# Altium project Flight_Controller_v1.PrjPcb (part 1 of 2)
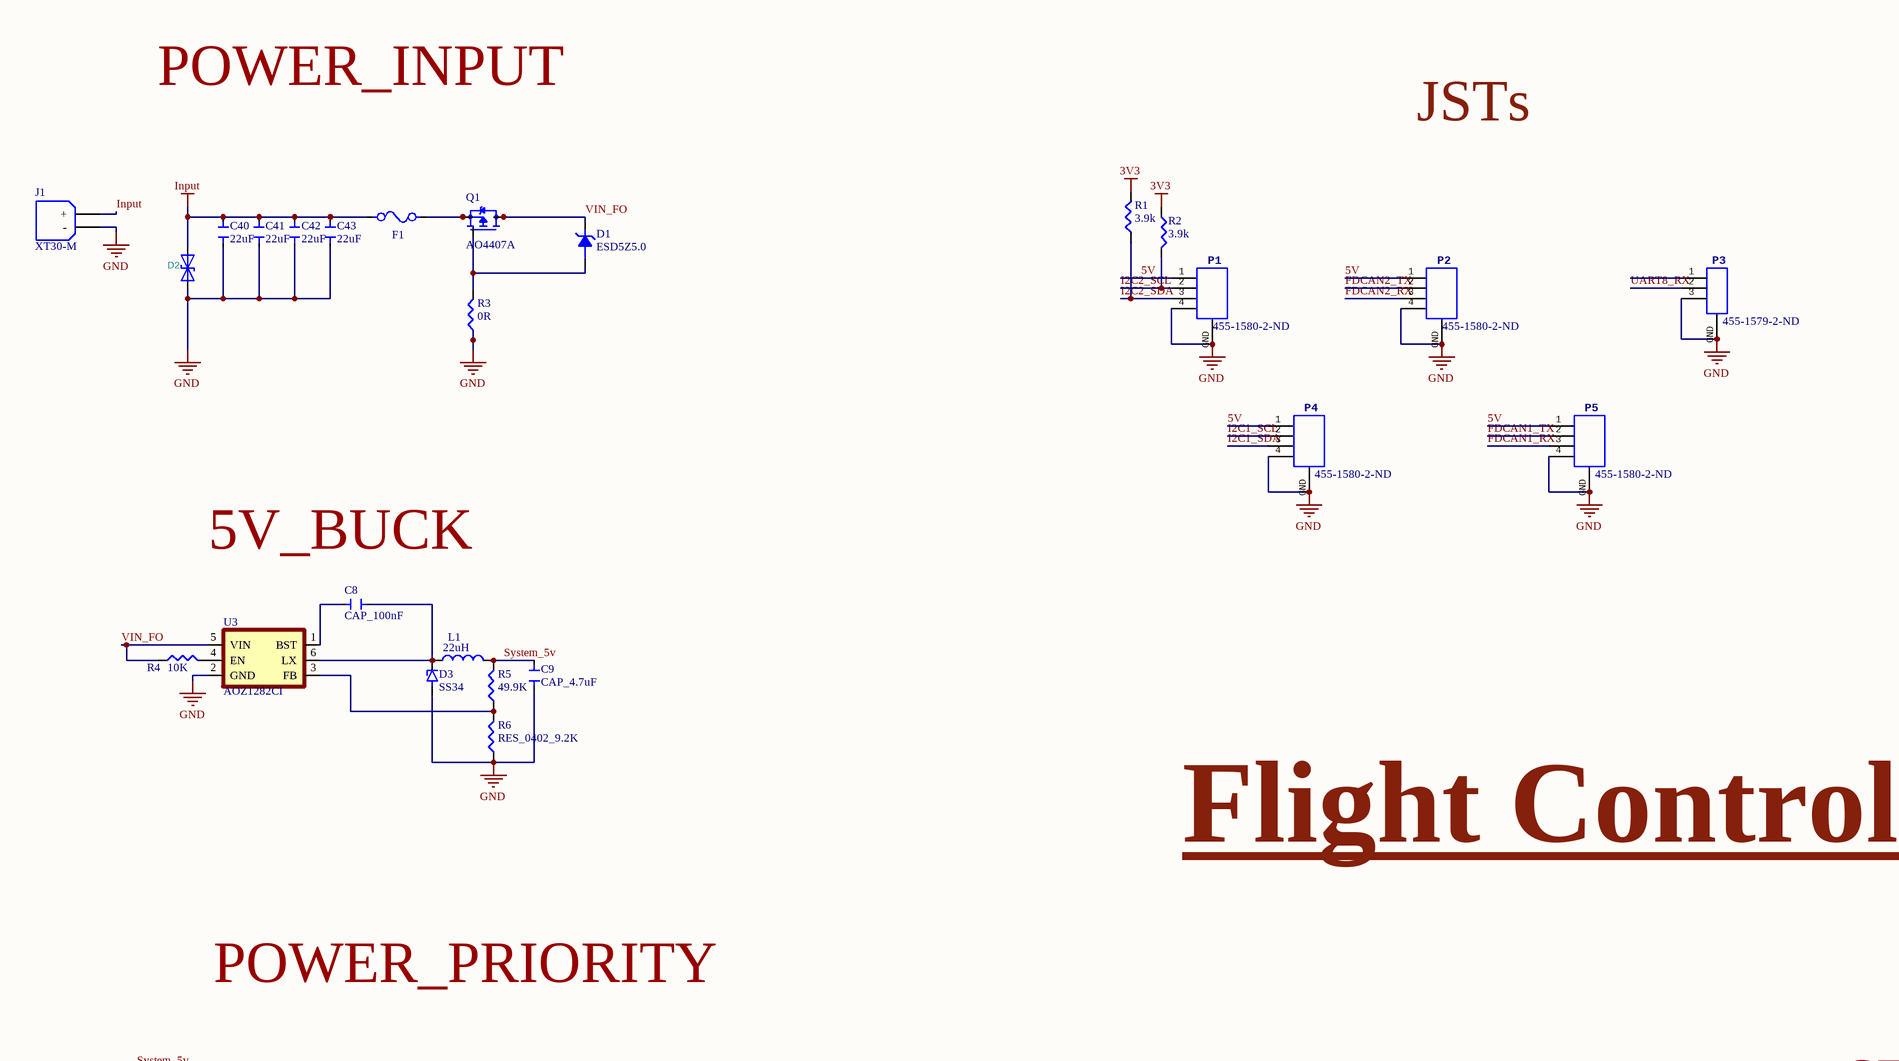
[diagram p0: Flight_Controller_v1.SchDoc, top left]
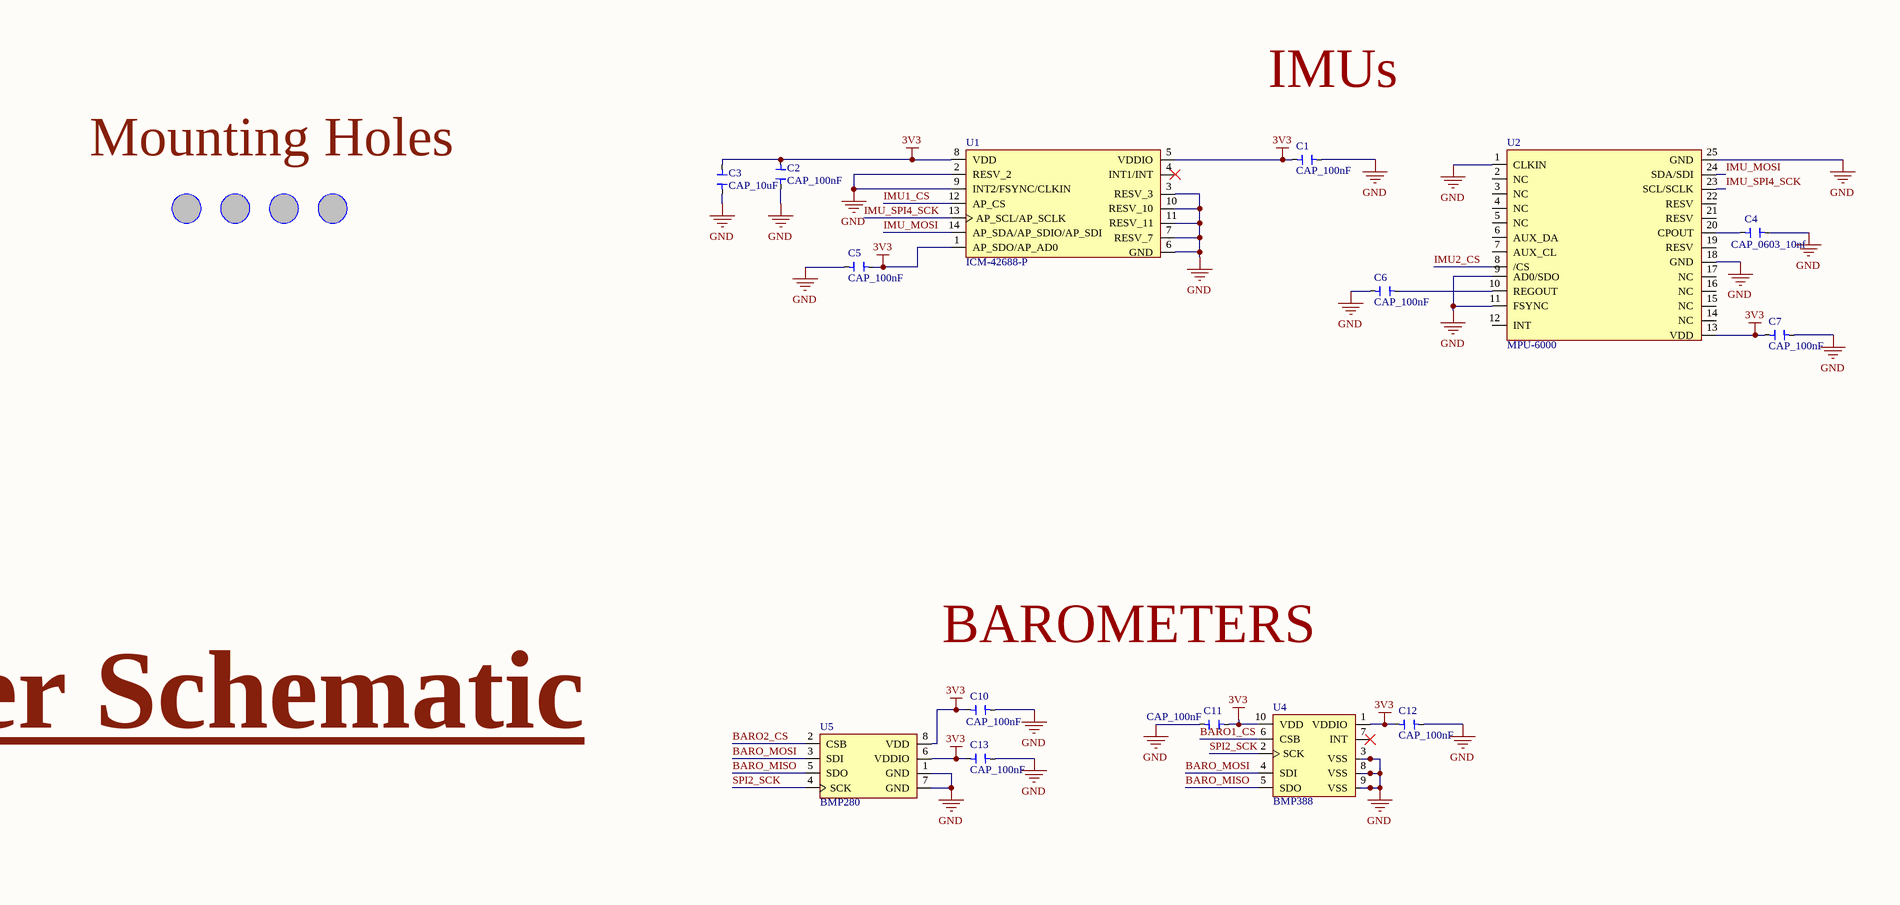
[diagram p1: Flight_Controller_v1.SchDoc, top right]
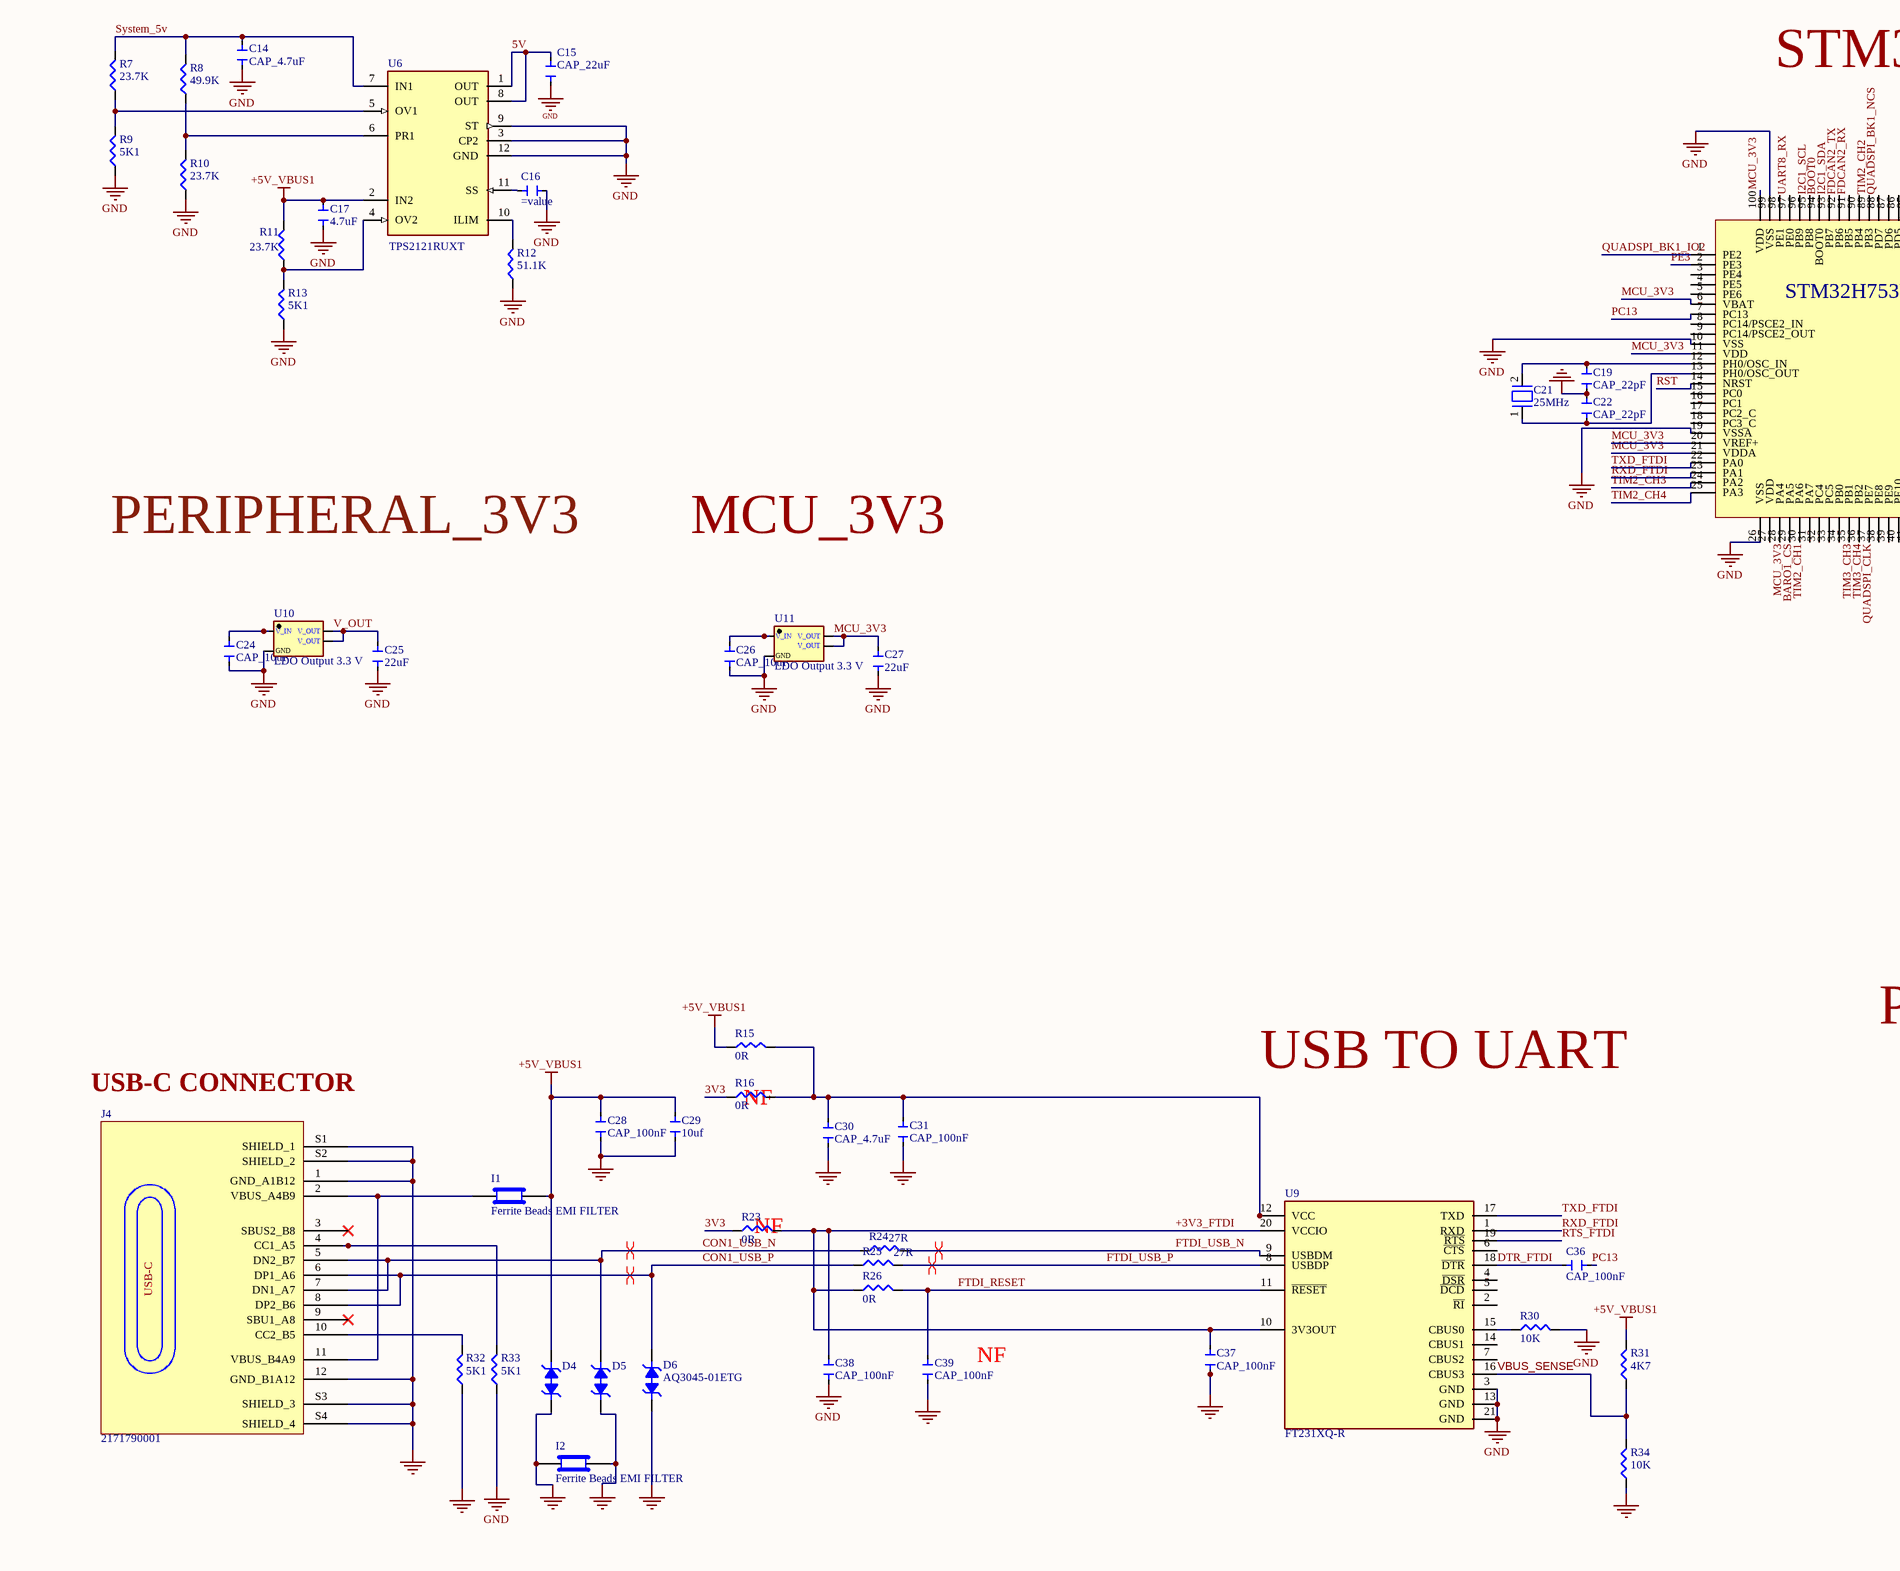
[diagram p2: Flight_Controller_v1.SchDoc, bottom left]
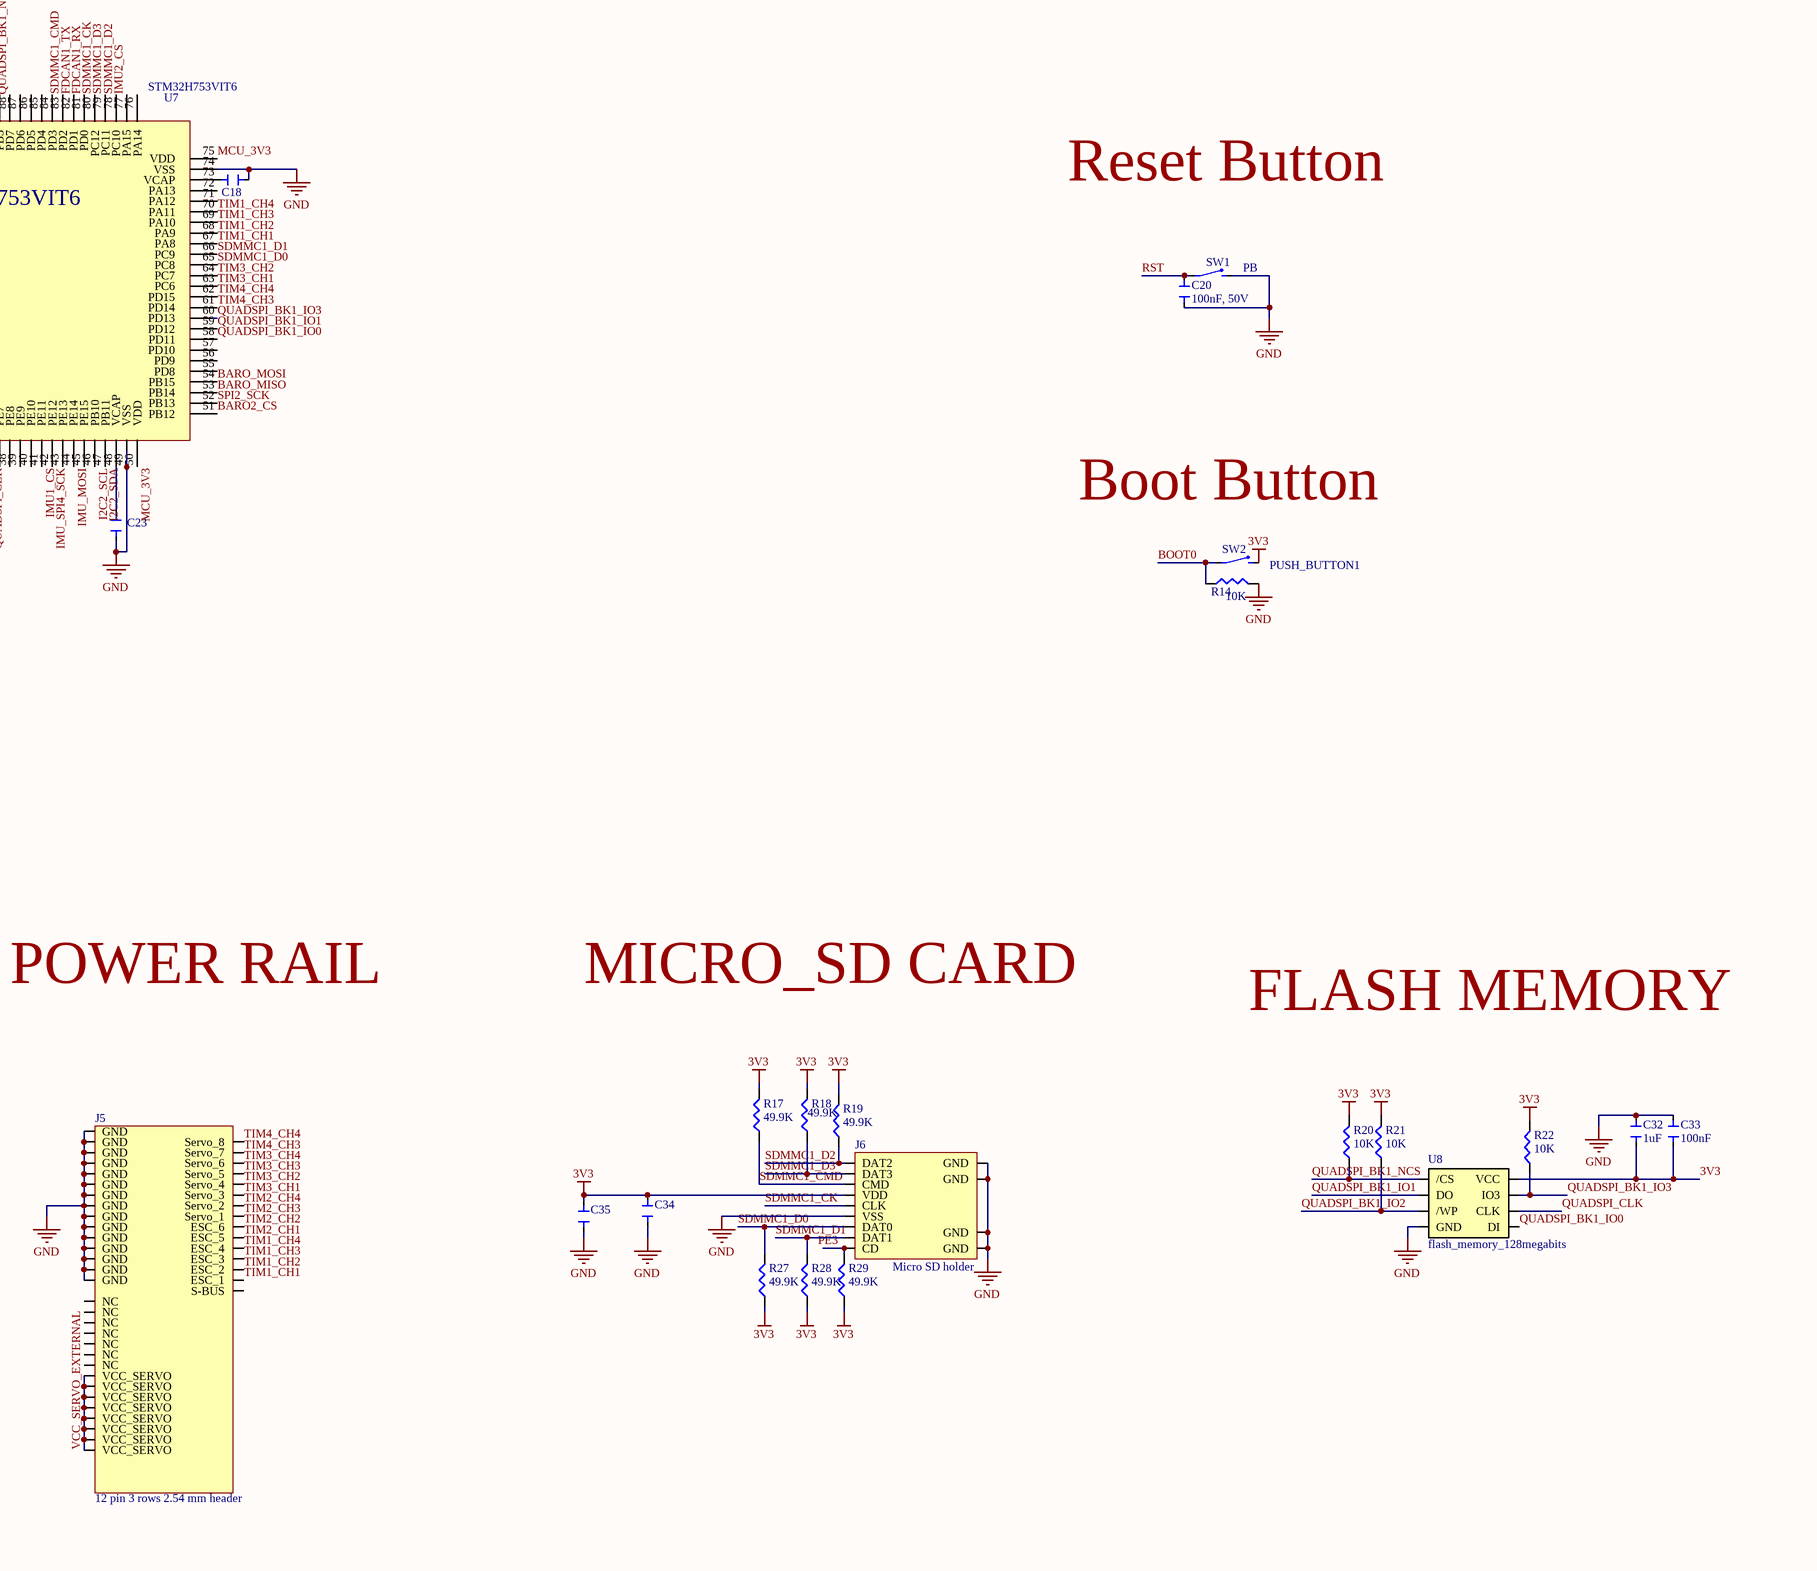
[diagram p3: Flight_Controller_v1.SchDoc, bottom right]
1 sheet, 110 parts. Net scope: global (net labels, ports and power ports of the same name join across sheets).
Board file: Flight_Controller_PCB.PcbDoc

## Sheet Flight_Controller_v1.SchDoc
size A1; SheetNumber: 1; SheetTotal: 1

### Parts
C1  CAP_100nF  [CAP_100nF]
C2  CAP_100nF  [CAP_100nF]
C3  CAP_10uF  [CAP_10uF]
C4  CAP_0603_10nf  [CAP_100nF]
C5  CAP_100nF  [CAP_100nF]
C6  CAP_100nF  [CAP_100nF]
C7  CAP_100nF  [CAP_100nF]
C8  CAP_100nF  [CAP_100nF]
C9  CAP_4.7uF  [CAP_4.7uF]
C10  CAP_100nF  [CAP_100nF]
C11  CAP_100nF  [CAP_100nF]
C12  CAP_100nF  [CAP_100nF]
C13  CAP_100nF  [CAP_100nF]
C14  CAP_4.7uF  [CAP_4.7uF]
C15  CAP_22uF  [CAP_22uF]
C16  (no value)  [CAP_100nF]
C17  4.7uF  [CAP_4.7uF]
C18  CAP_2.2uF  [CAP_4.7uF]  (value not drawn)
C19  CAP_22pF  [CAP_0402]
C20  100nF, 50V  [CAP_0402]
C21  25MHz  [XTAL 25 MHZ]
C22  CAP_22pF  [CAP_0402]
C23  CAP_2.2uF  [CAP_4.7uF]  (value not drawn)
C24  CAP_10uF  [CAP_10uF]
C25  22uF  [CAP_22uF]
C26  CAP_10uF  [CAP_10uF]
C27  22uF  [CAP_22uF]
C28  CAP_100nF  [CAP_100nF]
C29  10uf  [CAP_10uF]
C30  CAP_4.7uF  [CAP_4.7uF]
C31  CAP_100nF  [CAP_100nF]
C32  1uF  [CAP_4.7uF]
C33  100nF  [CAP_100nF]
C34  CAP_4.7uF  [CAP_4.7uF]  (value not drawn)
C35  CAP_100nF  [CAP_100nF]  (value not drawn)
C36  CAP_100nF  [CAP_100nF]
C37  CAP_100nF  [CAP_100nF]
C38  CAP_100nF  [CAP_100nF]
C39  CAP_100nF  [CAP_100nF]
C40  22uF  [CAP_22uF]
C41  22uF  [CAP_22uF]
C42  22uF  [CAP_22uF]
C43  22uF  [CAP_22uF]
D1  ESD5Z5.0  [SOD-523]
D2  TVS-bidirectional-Diode  [SOD-123FL_bi]  (value not drawn)
D3  SS34  [DIO_SS34]
D4  AQ3045-01ETG  [SOD882]  (value not drawn)
D5  (no value)  [SOD882]
D6  AQ3045-01ETG  [SOD882]
F1  0451020.MRL  [FP-0451-MFG]  (value not drawn)
I1  Ferrite Beads EMI FILTER  [KYOCERA-KNH16-DA]
I2  Ferrite Beads EMI FILTER  [KYOCERA-KNH16-DA]
J1  XT30-M  [XT30PW-M]
J4  2171790001  [USB_C]
J5  12 pin 3 rows 2.54 mm header  [PGA225x15]
J6  Micro SD holder  [Edge Connector]
L1  22uH  [12.3x12.3 - duplicate]
P1  Supplier Part Number 1: 455-1580-2-ND  [JST_GH_V4]  (hidden comment: JST_GH_V4)
P2  Supplier Part Number 1: 455-1580-2-ND  [JST_GH_V4]  (hidden comment: JST_GH_V4)
P3  Supplier Part Number 1: 455-1579-2-ND  [JST_GH_V3]  (hidden comment: JST_GH_V3)
P4  Supplier Part Number 1: 455-1580-2-ND  [JST_GH_V4]  (hidden comment: JST_GH_V4)
P5  Supplier Part Number 1: 455-1580-2-ND  [JST_GH_V4]  (hidden comment: JST_GH_V4)
Q1  AO4407A  [AO4407A]
R1  3.9k  [RES_3.9K]
R2  3.9k  [RES_3.9K]
R3  0R  [RES_SMD_0402]
R4  10K  [RES_SMD_0402]
R5  49.9K  [RES_SMD_0603]
R6  RES_0402_9.2K  [RES_SMD_0402]
R7  23.7K  [RES_SMD_0603]
R8  49.9K  [RES_SMD_0603]
R9  5K1  [RES_SMD_0402]
R10  23.7K  [RES_SMD_0603]
R11  23.7K  [RES_SMD_0603]
R12  51.1K  [RES_SMD_0603]
R13  5K1  [RES_SMD_0402]
R14  10K  [RES_SMD_0402]
R15  0R  [RES_SMD_0402]
R16  0R  [RES_SMD_0402]
R17  49.9K  [RES_SMD_0603]
R18  49.9K  [RES_SMD_0603]
R19  49.9K  [RES_SMD_0603]
R20  10K  [RES_SMD_0402]
R21  10K  [RES_SMD_0402]
R22  10K  [RES_SMD_0402]
R23  0R  [RES_SMD_0402]
R24  27R  [RES_SMD_0402]
R25  27R  [RES_SMD_0402]
R26  0R  [RES_SMD_0402]
R27  49.9K  [RES_SMD_0603]
R28  49.9K  [RES_SMD_0603]
R29  49.9K  [RES_SMD_0603]
R30  10K  [RES_SMD_0402]
R31  4K7  [RES_SMD_0402]
R32  5K1  [RES_SMD_0402]
R33  5K1  [RES_SMD_0402]
R34  10K  [RES_SMD_0402]
SW1  PB  [PUSH_BUTTON1]
SW2  PUSH_BUTTON1  [PUSH_BUTTON1]
U1  ICM-42688-P  [PQFN50P300X250X97-14N]
U2  MPU-6000  [MPU-6000]
U3  AOZ1282CI  [AOZ1282CI]
U4  BMP388  [PQFN50P200X200X80-10N]
U5  BMP280  [XDCR_BMP280]
U6  TPS2121RUXT  [FP-RUX0012A-MFG]
U7  STM32H753VIT6  [LQFP100-14x14mm]
U8  flash_memory_128megabits  [SOIC-8-208mil]
U9  FT231XQ-R  [FP-QFN-20-IPC_B]
U10  LDO Output 3.3 V  [AMS1117]
U11  LDO Output 3.3 V  [AMS1117]

### Nets
3V3: C1.1 C2.1 C3.2 C5.1 C7.1 C10.1 C11.1 C12.1 C13.1 C32.2 C33.1 C34.1 C35.1 J6.4(VDD) R1.2 R2.1 R16.1 R17.2 R18.2 R19.2 R20.2 R21.2 R22.2 R23.1 R27.1 R28.1 R29.1 SW2.2 U1.1(AP_SDO/AP_AD0) U1.5(VDDIO) U1.8(VDD) U2.13(VDD) U4.1(VDDIO) U4.10(VDD) U5.6(VDDIO) U5.8(VDD) U8.8(VCC)
+5V_VBUS1: C17.2 C28.2 C29.2 D4.2 I1.2 R11.2 R15.1 R31.2 U6.2(IN2)
GND: C1.2 C2.2 C3.1 C4.2 C5.2 C6.1 C7.2 C9.1 C10.2 C11.2 C12.2 C13.2 C14.1 C15.1 C16.2 C17.1 C18.2 C19.1 C20.1 C22.2 C23.2 C24.1 C25.1 C26.1 C27.1 C28.1 C29.1 C30.1 C31.1 C32.1 C33.2 C34.2 C35.2 C37.1 C38.1 C39.1 C40.1 C41.1 C42.1 C43.1 D2.1 D3.A D4.1 D5.1 D6.1 I2.1 I2.2 J1.2(-) J4.1(GND_A1B12) J4.12(GND_B1A12) J4.S1(SHIELD_1) J4.S2(SHIELD_2) J4.S3(SHIELD_3) J4.S4(SHIELD_4) J5.1(GND) J5.2(GND) J5.3(GND) J5.4(GND) J5.5(GND) J5.6(GND) J5.7(GND) J5.8(GND) J5.9(GND) J5.10(GND) J5.11(GND) J5.12(GND) J5.13(GND) J5.14(GND) J5.15(GND) J6.6(VSS) J6.10(GND) J6.11(GND) J6.12(GND) J6.13(GND) P1.4 P1.GND P2.4 P2.GND P3.3 P3.GND P4.4 P4.GND P5.4 P5.GND R3.1 R6.1 R9.1 R10.1 R12.1 R13.1 R14.2 R30.2 R32.1 R33.1 R34.1 SW1.2 U1.2(RESV_2) U1.3(RESV_3) U1.6(GND) U1.7(RESV_7) U1.9(INT2/FSYNC/CLKIN) U1.10(RESV_10) U1.11(RESV_11) U2.1(CLKIN) U2.9(AD0/SDO) U2.11(FSYNC) U2.18(GND) U2.25(GND) U3.2(GND) U4.3(VSS) U4.8(VSS) U4.9(VSS) U5.1(GND) U5.7(GND) U6.3(CP2) U6.9(ST) U6.12(GND) U7.10(VSS) U7.19(VSSA) U7.26(VSS) U7.49(VSS) U7.74(VSS) U7.99(VSS) U8.4(GND) U9.3(GND) U9.13(GND) U9.21(GND) U10.1(GND) U11.1(GND)
Input: C40.2 C41.2 C42.2 C43.2 D2.2 F1.1 J1.1(+)
5V: C15.2 P1.1 P2.1 P4.1 P5.1 U6.1(OUT) U6.8(OUT)
+3V3_FTDI: C37.2 C38.2 R23.2 R26.1 U9.10(3V3OUT) U9.20(VCCIO)
BARO1_CS: U4.6(CSB) U7.28(PA4)
BARO2_CS: U5.2(CSB) U7.51(PB12)
BARO_MISO: U4.5(SDO) U5.5(SDO) U7.53(PB14)
BARO_MOSI: U4.4(SDI) U5.3(SDI) U7.54(PB15)
BOOT0: R14.1 SW2.1 U7.94(BOOT0)
CON1_USB_N: D5.2 J4.5(DN2_B7) J4.7(DN1_A7) R24.1
CON1_USB_P: D6.2 J4.6(DP1_A6) J4.8(DP2_B6) R25.1
DTR_FTDI: C36.1 U9.18(~{DTR})
FDCAN1_RX: P5.3 U7.81(PD0)
FDCAN1_TX: P5.2 U7.82(PD1)
FDCAN2_RX: P2.3 U7.91(PB5)
FDCAN2_TX: P2.2 U7.92(PB6)
FTDI_RESET: C39.2 R26.2 U9.11(~{RESET})
FTDI_USB_N: R24.2 U9.9(USBDM)
FTDI_USB_P: R25.2 U9.8(USBDP)
I2C1_SCL: P4.2 U7.95(PB8)
I2C1_SDA: P4.3 U7.93(PB7)
I2C2_SCL: P1.2 R2.2 U7.46(PB10)
I2C2_SDA: P1.3 R1.1 U7.47(PB11)
IMU1_CS: U1.12(AP_CS) U7.41(PE11)
IMU2_CS: U2.8(/CS) U7.77(PA15)
IMU_MOSI: U1.14(AP_SDA/AP_SDIO/AP_SDI) U2.24(SDA/SDI) U7.44(PE14)
IMU_SPI4_SCK: U1.13(AP_SCL/AP_SCLK) U2.23(SCL/SCLK) U7.42(PE12)
MCU_3V3: C27.2 U7.6(VBAT) U7.11(VDD) U7.20(VREF+) U7.21(VDDA) U7.27(VDD) U7.50(VDD) U7.75(VDD) U7.100(VDD) U11.2(V_OUT) U11.4(V_OUT)
PC13: C36.2 U7.7(PC13)
PE3: U7.2(PE3)
QUADSPI_BK1_IO0: U7.58(PD11) U8.5(DI)
QUADSPI_BK1_IO1: U7.59(PD12) U8.2(DO)
QUADSPI_BK1_IO2: R21.1 U7.1(PE2) U8.3(/WP)
QUADSPI_BK1_IO3: R22.1 U7.60(PD13) U8.7(IO3)
QUADSPI_BK1_NCS: R20.1 U7.88(PD7) U8.1(/CS)
QUADSPI_CLK: U7.36(PB2) U8.6(CLK)
RST: C20.2 SW1.1 U7.14(NRST)
RTS_FTDI: U9.19(~{RTS})
RXD_FTDI: U7.23(PA1) U9.1(RXD)
SDMMC1_CK: J6.5(CLK) U7.80(PC12)
SDMMC1_CMD: J6.3(CMD) R17.1 U7.83(PD2)
SDMMC1_D0: J6.7(DAT0) R27.2 U7.65(PC8)
SDMMC1_D1: J6.8(DAT1) R28.2 U7.66(PC9)
SDMMC1_D2: J6.1(DAT2) R19.1 U7.78(PC10)
SDMMC1_D3: J6.2(DAT3) R18.1 U7.79(PC11)
SPI2_SCK: U4.2(SCK) U5.4(SCK) U7.52(PB13)
System_5v: C9.2 C14.2 L1.2 R5.2 R7.2 R8.2 U6.7(IN1)
TIM1_CH1: J5.32(ESC_1) U7.67(PA8)
TIM1_CH2: J5.33(ESC_2) U7.68(PA9)
TIM1_CH3: J5.34(ESC_3) U7.69(PA10)
TIM1_CH4: J5.35(ESC_4) U7.70(PA11)
TIM2_CH1: J5.36(ESC_5) U7.29(PA5)
TIM2_CH2: J5.37(ESC_6) U7.89(PB3)
TIM2_CH3: J5.38(Servo_1) U7.24(PA2)
TIM2_CH4: J5.39(Servo_2) U7.25(PA3)
TIM3_CH1: J5.40(Servo_3) U7.63(PC6)
TIM3_CH2: J5.41(Servo_4) U7.64(PC7)
TIM3_CH3: J5.42(Servo_5) U7.34(PB0)
TIM3_CH4: J5.43(Servo_6) U7.35(PB1)
TIM4_CH3: J5.44(Servo_7) U7.61(PD14)
TIM4_CH4: J5.45(Servo_8) U7.62(PD15)
TXD_FTDI: U7.22(PA0) U9.17(TXD)
UART8_RX: P3.2 U7.97(PE0)
V_OUT: C25.2 U10.2(V_OUT) U10.4(V_OUT)
VBUS_SENSE: R31.1 R34.2 U9.16(CBUS3)
VCC_SERVO_EXTERNAL: J5.23(VCC_SERVO) J5.24(VCC_SERVO) J5.25(VCC_SERVO) J5.26(VCC_SERVO) J5.27(VCC_SERVO) J5.28(VCC_SERVO) J5.29(VCC_SERVO) J5.30(VCC_SERVO)
VIN_FO: D1.K Q1.5(D) Q1.6(D) Q1.7(D) Q1.8(D) R4.1 U3.5(VIN)
NetC4_1: C4.1 U2.20(CPOUT)
NetC6_2: C6.2 U2.10(REGOUT)
NetC8_1: C8.1 D3.C L1.1 U3.6(LX)
NetC8_2: C8.2 U3.1(BST)
NetC16_1: C16.1 U6.11(SS)
NetC18_1: C18.1 U7.73(VCAP)
NetC19_2: C19.2 C21.2 U7.12(PH0/OSC_IN)
NetC21_1: C21.1 C22.1 U7.13(PH0/OSC_OUT)
NetC23_1: C23.1 U7.48(VCAP)
NetC24_2: C24.2 U10.3(V_IN)
NetC26_2: C26.2 U11.3(V_IN)
NetC30_2: C30.2 C31.2 R15.2 R16.2 U9.12(VCC)
NetD1_A: D1.A Q1.4(G) R3.2
NetF1_2: F1.2 Q1.1(S) Q1.2(S) Q1.3(S)
NetI1_1: I1.1 J4.2(VBUS_A4B9) J4.11(VBUS_B4A9)
NetJ4_4: J4.4(CC1_A5) R33.2
NetJ4_10: J4.10(CC2_B5) R32.2
NetJ6_9: J6.9(CD) R29.2
NetR4_2: R4.2 U3.4(EN)
NetR5_1: R5.1 R6.2 U3.3(FB)
NetR7_1: R7.1 R9.2 U6.5(OV1)
NetR8_1: R8.1 R10.2 U6.6(PR1)
NetR11_1: R11.1 R13.2 U6.4(OV2)
NetR12_2: R12.2 U6.10(ILIM)
NetR30_1: R30.1 U9.15(CBUS0)

Not connected (* = marked no-connect by the designer): J4 3(SBUS2_B8)* 9(SBU1_A8)*; J5 16(NC) 17(NC) 18(NC) 19(NC) 20(NC) 21(NC) 22(NC) 31(S-BUS); P3 1; U1 4(INT1/INT)*; U2 2(NC) 3(NC) 4(NC) 5(NC) 6(AUX_DA) 7(AUX_CL) 12(INT) 14(NC) 15(NC) 16(NC) 17(NC) 19(RESV) 21(RESV) 22(RESV); U4 7(INT)*; U7 3(PE4) 4(PE5) 5(PE6) 8(PC14/PSCE2_IN) 9(PC14/PSCE2_OUT) 15(PC0) 16(PC1) 17(PC2_C) 18(PC3_C) 30(PA6) 31(PA7) 32(PC4) 33(PC5) 37(PE7) 38(PE8) 39(PE9) 40(PE10) 43(PE13) 45(PE15) 55(PD8) 56(PD9) 57(PD10) 71(PA12) 72(PA13) 76(PA14) 84(PD3) 85(PD4) 86(PD5) 87(PD6) 90(PB4) 96(PB9) 98(PE1); U9 2(~{RI}) 4(~{DSR}) 5(~{DCD}) 6(~{CTS}) 7(CBUS2) 14(CBUS1)

### Layout directives
differential pair; differential pair class DIFF90: CON1_USB_N, CON1_USB_P, FTDI_USB_N, FTDI_USB_P

### Notes on the sheet
- POWER_INPUT
- JSTs
- IMUs
- Mounting Holes
- (near C8) 5V_BUCK
- BAROMETERS
- Flight Controller Schematic
- POWER_PRIORITY
- STM32
- Reset Button
- PERIPHERAL_3V3
- MCU_3V3
- Boot Button
- POWER RAIL
- MICRO_SD CARD
- (near J4) USB-C CONNECTOR
- (near R16) NF
- USB TO UART
- FLASH MEMORY
- (near R23) NF
- NF
- Labels drawn without touching a wire or pin: PE3
- (in symbol USB_C) USB-C